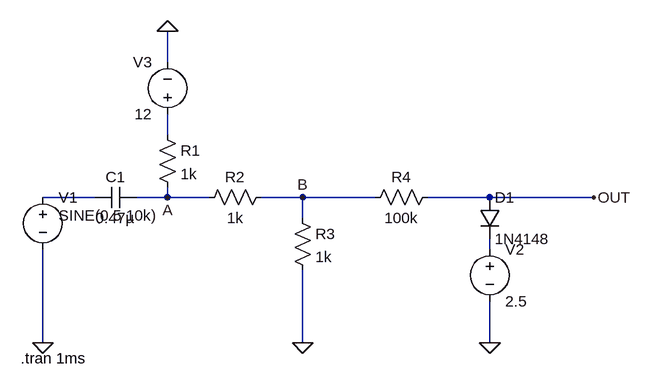
[diagram p0: schematic circuito_3_lab_1.asc]
circuito_3_lab_1.asc, the LTspice schematic file:
Version 4
SHEET 1 880 680
WIRE 144 -80 144 -128
WIRE 144 32 144 0
WIRE 32 128 -48 128
WIRE 144 128 144 112
WIRE 144 128 96 128
WIRE 208 128 144 128
WIRE 352 128 288 128
WIRE 464 128 352 128
WIRE 640 128 544 128
WIRE 800 128 640 128
WIRE 352 160 352 128
WIRE 640 208 640 192
WIRE -48 352 -48 208
WIRE 352 352 352 240
WIRE 640 352 640 288
FLAG 640 352 0
FLAG 352 352 0
FLAG -48 352 0
FLAG 144 -128 0
FLAG 800 128 OUT
FLAG 144 128 A
FLAG 352 128 B
SYMBOL voltage -48 112 R0
WINDOW 3 24 44 Left 2
WINDOW 123 0 0 Left 0
WINDOW 39 0 0 Left 0
SYMATTR InstName V1
SYMATTR Value SINE(0 5 10k)
SYMBOL res 128 16 R0
SYMATTR InstName R1
SYMATTR Value 1k
SYMBOL res 336 144 R0
SYMATTR InstName R3
SYMATTR Value 1k
SYMBOL res 304 112 R90
WINDOW 0 0 56 VBottom 2
WINDOW 3 32 56 VTop 2
SYMATTR InstName R2
SYMATTR Value 1k
SYMBOL res 560 112 R90
WINDOW 0 0 56 VBottom 2
WINDOW 3 32 56 VTop 2
SYMATTR InstName R4
SYMATTR Value 100k
SYMBOL diode 624 128 R0
SYMATTR InstName D1
SYMATTR Value 1N4148
SYMBOL voltage 640 192 R0
WINDOW 123 0 0 Left 0
WINDOW 39 0 0 Left 0
SYMATTR InstName V2
SYMATTR Value 2.5
SYMBOL cap 96 112 R90
WINDOW 0 0 32 VBottom 2
WINDOW 3 32 32 VTop 2
SYMATTR InstName C1
SYMATTR Value 0.47µ
SYMBOL voltage 144 16 R180
WINDOW 0 24 96 Left 2
WINDOW 3 24 16 Left 2
WINDOW 123 0 0 Left 0
WINDOW 39 0 0 Left 0
SYMATTR InstName V3
SYMATTR Value 12
TEXT -82 376 Left 2 !.tran 1ms

The netlist it stands for:
* circuito_3_lab_1.asc
V1 N002 0 SINE(0 5 10k)
R1 N001 A 1k
R3 B 0 1k
R2 B A 1k
R4 OUT B 100k
D1 OUT N003 1N4148
V2 N003 0 2.5
C1 A N002 0.47µ
V3 N001 0 12
.model D D
.lib standard.dio
.tran 1ms
.backanno
.end